# Altium project SeniorDesign_PowerBoard.PrjPcb
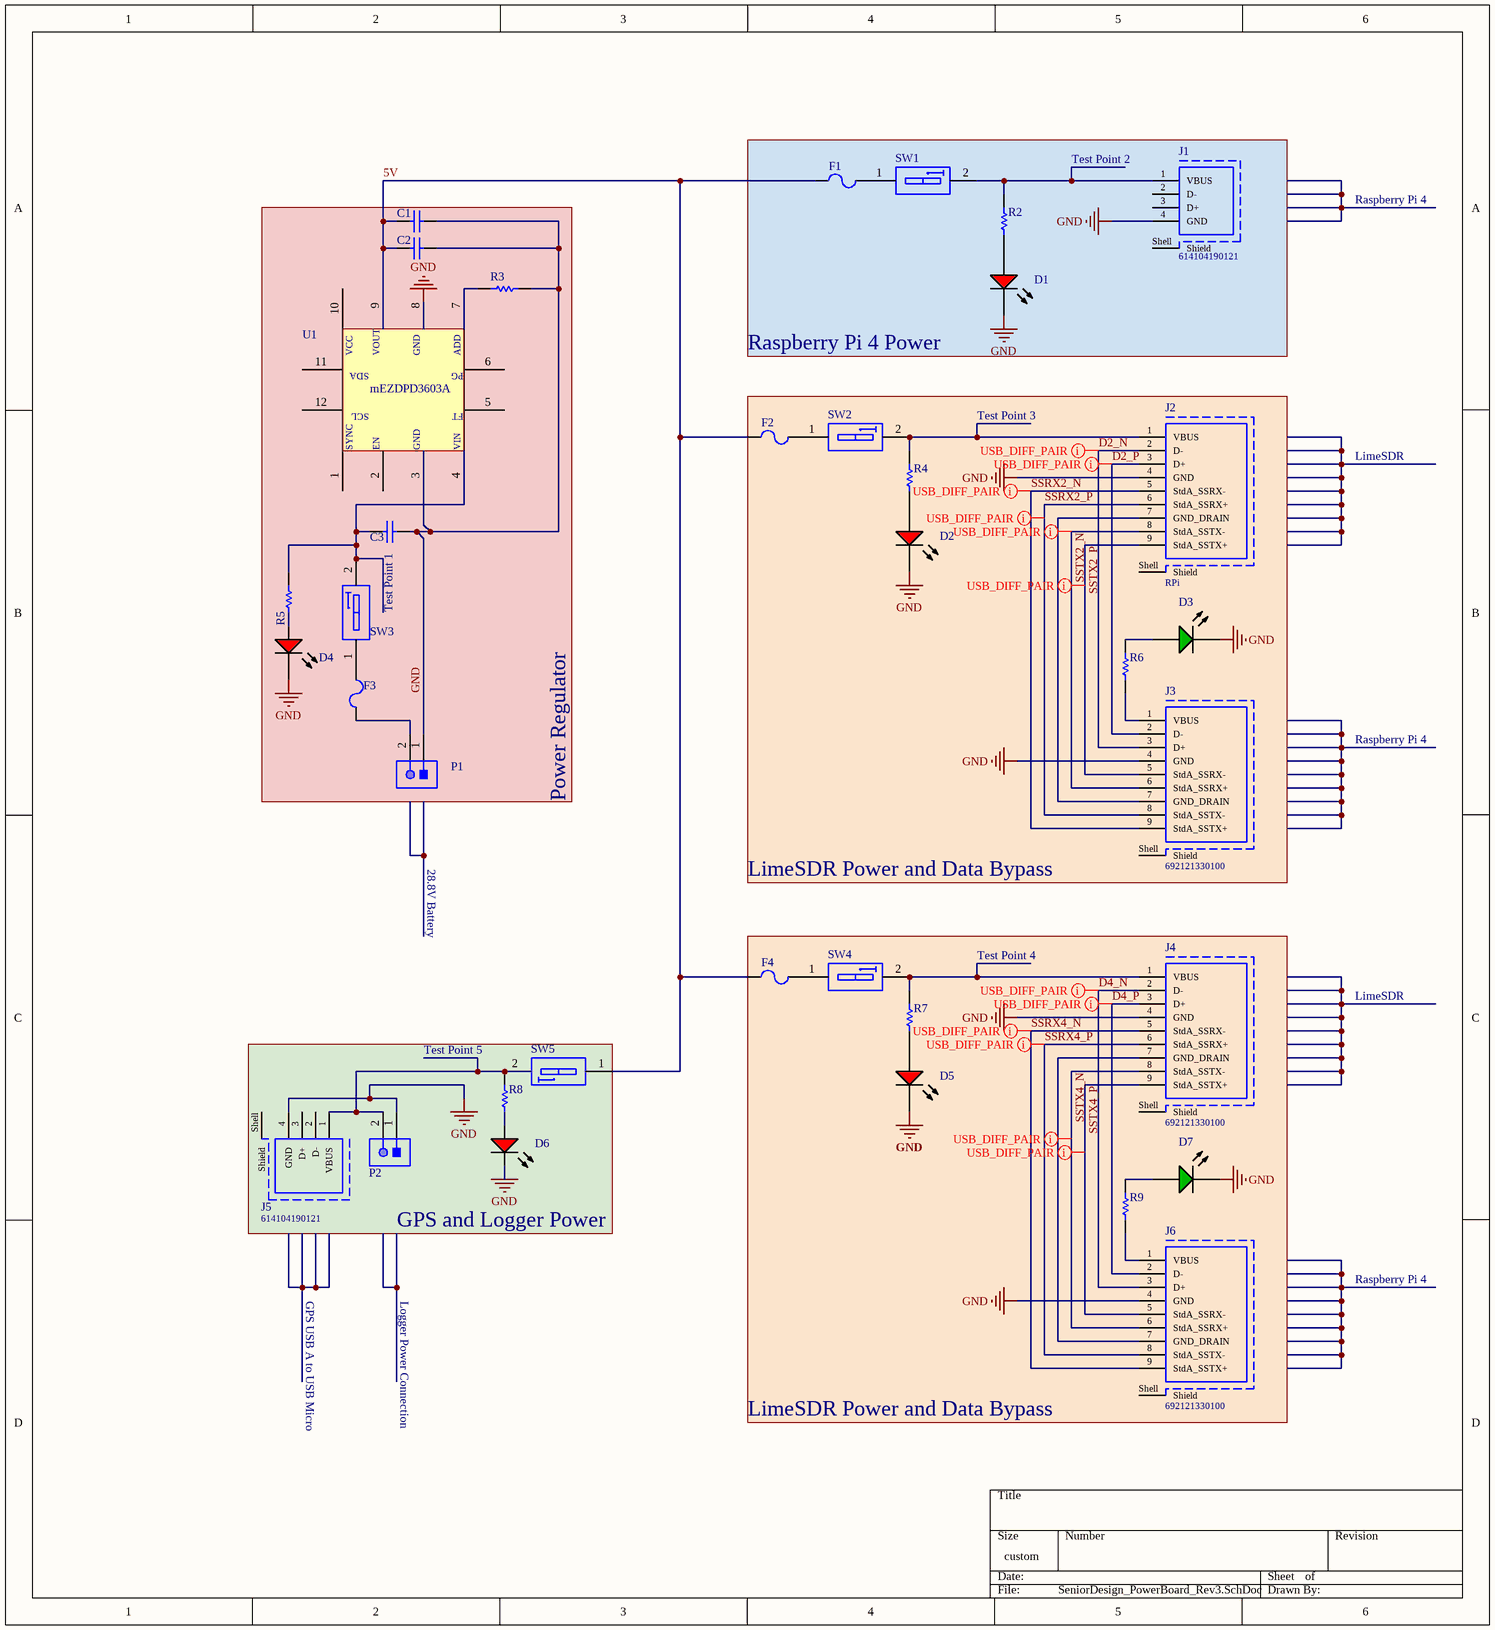
[diagram p0: SeniorDesign_PowerBoard_Rev3.SchDoc]
1 sheet, 36 parts. Net scope: global (net labels, ports and power ports of the same name join across sheets).
Board file: SeniorDesign_PowerBoard_Rev1.PcbDoc

## Sheet SeniorDesign_PowerBoard_Rev3.SchDoc
size 279 x 304 mm

### Parts
C1  GRM188R61A226ME15D  [CAPC1608X100X38LL20T18]  (value not drawn)
C2  GRM188R61A226ME15D  [CAPC1608X100X38LL20T18]  (value not drawn)
C3  GRM31CR71H475KA12L  [MURA-1206_H_1.8_M]  (value not drawn)
D1  HSMH-C150  [AVAG-HSMX-C150_V]  (value not drawn)
D2  HSMH-C150  [AVAG-HSMX-C150_V]  (value not drawn)
D3  HSMG-C150  [AVAG-HSMX-C150_V]  (value not drawn)
D4  HSMH-C150  [AVAG-HSMX-C150_V]  (value not drawn)
D5  HSMH-C150  [AVAG-HSMX-C150_V]  (value not drawn)
D6  HSMH-C150  [AVAG-HSMX-C150_V]  (value not drawn)
D7  HSMG-C150  [AVAG-HSMX-C150_V]  (value not drawn)
F1  0263.500WRT1L  [LFUS-263-2_V1]  (value not drawn)
F2  0263.500WRT1L  [LFUS-263-2_V1]  (value not drawn)
F3  0263.500WRT1L  [LFUS-263-2_V1]  (value not drawn)
F4  0263.500WRT1L  [LFUS-263-2_V1]  (value not drawn)
J1  614104190121  [614104190121]
J2  RPi  [692121330100]
J3  692121330100  [692121330100]
J4  692121330100  [692121330100]
J5  614104190121  [614104190121]
J6  692121330100  [692121330100]
P1  S2B-PH-K-S(LF)(SN)  [JST-S2B-PH-K-S_V]  (value not drawn)
P2  S2B-PH-K-S(LF)(SN)  [JST-S2B-PH-K-S_V]  (value not drawn)
R2  CRCW0402150RFKED  [RESC1005X40X25LL05T05]  (value not drawn)
R3  ADD  [RESC2013X50X30LL20T20]  (value not drawn)
R4  CRCW0402150RFKED  [RESC1005X40X25LL05T05]  (value not drawn)
R5  ERJ-8ENF1501V  [RESC3216X70X50LL05T20]  (value not drawn)
R6  CRCW0402150RFKED  [RESC1005X40X25LL05T05]  (value not drawn)
R7  CRCW0402150RFKED  [RESC1005X40X25LL05T05]  (value not drawn)
R8  CRCW0402150RFKED  [RESC1005X40X25LL05T05]  (value not drawn)
R9  CRCW0402150RFKED  [RESC1005X40X25LL05T05]  (value not drawn)
SW1  418121160801  [418121160801]  (value not drawn)
SW2  418121160801  [418121160801]  (value not drawn)
SW3  418121160801  [418121160801]  (value not drawn)
SW4  418121160801  [418121160801]  (value not drawn)
SW5  418121160801  [418121160801]  (value not drawn)
U1  DC/DC Converter  [mEZDPD3603A]  (value not drawn)

### Blocks framed on the sheet
Raspberry Pi 4 Power: D1 F1 J1 R2 SW1
Test Point 1: C1-C3 D4 F3 P1 R3 R5 SW3 U1
LimeSDR Power and Data Bypass: D2 D3 F2 J2 J3 R4 R6 SW2
LimeSDR Power and Data Bypass: D5 D7 F4 J4 J6 R7 R9 SW4
GPS and Logger Power: D6 J5 P2 R8 SW5

### Nets
GND: C1.1 C2.1 C3.1 D1.2(K) D2.2(K) D3.2(K) D4.2(K) D5.2(K) D6.2(K) D7.2(K) J1.4(GND) J2.4(GND) J3.4(GND) J4.4(GND) J5.4(GND) J6.4(GND) P1.1 P2.1 R3.1 U1.3(GND) U1.8(GND)
5V: C1.2 C2.2 F1.2 F2.2 F4.2 SW5.1 U1.9(VOUT)
D2_N: J2.2(D-) J3.3(D+)
D2_P: J2.3(D+) J3.2(D-)
D4_N: J4.2(D-) J6.3(D+)
D4_P: J4.3(D+) J6.2(D-)
SSRX2_N: J2.5(StdA_SSRX-) J3.9(StdA_SSTX+)
SSRX2_P: J2.6(StdA_SSRX+) J3.8(StdA_SSTX-)
SSRX4_N: J4.5(StdA_SSRX-) J6.9(StdA_SSTX+)
SSRX4_P: J4.6(StdA_SSRX+) J6.8(StdA_SSTX-)
SSTX2_N: J2.8(StdA_SSTX-) J3.6(StdA_SSRX+)
SSTX2_P: J2.9(StdA_SSTX+) J3.5(StdA_SSRX-)
SSTX4_N: J4.8(StdA_SSTX-) J6.6(StdA_SSRX+)
SSTX4_P: J4.9(StdA_SSTX+) J6.5(StdA_SSRX-)
NetC3_2: C3.2 R5.2 SW3.2 U1.4(VIN)
NetD1_1: D1.1(A) R2.1
NetD2_1: D2.1(A) R4.1
NetD3_1: D3.1(A) R6.2
NetD4_1: D4.1(A) R5.1
NetD5_1: D5.1(A) R7.1
NetD6_1: D6.1(A) R8.1
NetD7_1: D7.1(A) R9.2
NetF1_1: F1.1 SW1.1
NetF2_1: F2.1 SW2.1
NetF3_1: F3.1 P1.2
NetF3_2: F3.2 SW3.1
NetF4_1: F4.1 SW4.1
NetJ1_1: J1.1(VBUS) R2.2 SW1.2
NetJ2_1: J2.1(VBUS) R4.2 SW2.2
NetJ2_7: J2.7(GND_DRAIN) J3.7(GND_DRAIN)
NetJ3_1: J3.1(VBUS) R6.1
NetJ4_1: J4.1(VBUS) R7.2 SW4.2
NetJ4_7: J4.7(GND_DRAIN) J6.7(GND_DRAIN)
NetJ5_1: J5.1(VBUS) P2.2 R8.2 SW5.2
NetJ6_1: J6.1(VBUS) R9.1
NetR3_2: R3.2 U1.7(ADD)

Not connected (* = marked no-connect by the designer): J1 2(D-) 3(D+) Shell(Shield); J2 Shell(Shield); J3 Shell(Shield); J4 Shell(Shield); J5 2(D-) 3(D+) Shell(Shield); J6 Shell(Shield); U1 1(_SYNC) 2(EN) 5(FT) 6(PG) 10(VCC) 11(SDA) 12(SCL)

### Layout directives
differential pair; differential pair class USB_DIFF_PAIR: D2_N, D2_P, D4_N, D4_P, SSRX2_N, SSRX2_P, SSRX4_N, SSRX4_P, SSTX2_N, SSTX2_P, SSTX4_N, SSTX4_P

### Notes on the sheet
- (near J1) Test Point 2
- Raspberry Pi 4
- Test Point 3
- LimeSDR
- Power Regulator
- 28.8V Battery
- Test Point 4
- Test Point 5
- GPS USB A to USB Micro
- Logger Power Connection
- (in symbol DC/DC Converter) mEZDPD3603A

### Library data of the parts
C1 C2 = CMP-2000-06337-1: Chip Capacitor, 22 uF, +/- 20%, 10 V, -55 to 85 degC, 0603 (1608 Metric), RoHS, Tape and Reel; Manufacturer: Murata; Voltage Rating DC: 10VDC; Capacitance: 22uF; Dielectric: X5R; Unit Weight: 0.000222oz; Brand: MurataElectronics; Type: VoltageandTemperatureDeratingRecommendedProduct; Case Code - in: 0603; Package Reference: 1608; Package Description: 2-Pin Surface Mount Device, Body 1.6 x 0.8 mm; Width: 0.8mm; Factory Pack Quantity: 4000; Series: GRM; Product Category: MultilayerCeramicCapacitorsMLCC-SMD/SMT; Length: 1.6mm; Datasheet URL: http://download.siliconexpert.com/pdfs/2016/4/15/5/14/5/748/mrt_/manual/267693161154190grm188r61a226me1523.pdf; Termination Style: SMD/SMT; RoHS: True; Packaging: Reel; Datasheet Version: 04/2016; Minimum Operating Temperature: -55C; Tolerance: 20%; Height: 0.8mm; Package / Case: 0603(1608metric); Mounting Technology: SurfaceMount; Manufacturer URL: http://www.murata.com/; Product: GeneralTypeMLCCs; Maximum Operating Temperature: +85C; Case Code - mm: 1608
C3 = CMP-2000-05258-1: CAP, Ceramic, 4.7 uF, 10%, 50 V, 1206, RoHS, Tape and Reel; Manufacturer: Murata; Capacitance: 4700000pF; Dielectric: X7R; Rated Voltage: 50V; Manufacturer URL: http://www.murata.com/; Datasheet URL: https://datasheet.ciiva.com/29201/451984-da-01-en-vs-kondensator-0603-29201725.pdf; Datasheet Version: Dec-10; Case Size/Dimension: 1206; Tolerance (%): ±10%
D1 D2 D4-D6 = CMP-2000-06426-1: LED Uni-Color Red, 65 mW, 25 mA, -40 to 85 degC, 2-Pin SMD, RoHS, Tape and Reel; Manufacturer: Avago; Product Height (mm): 1.1mm; Power Dissipation: 78W; Product Length (mm): 3.2mm; Forward Voltage: 2.6V; Luminous Intensity: 17mcd; DELETED: Compliant; Shape Type: Rectangular; Peak Wavelength: 660nm; Main Category: ChipLED; Dominant Wave Length: 639nm; Rad Hardened: No; Lens Type: ColorlessDiffused; Product Depth (mm): 1.6mm; Reverse Voltage: 5V; Forward Current: 25mA; Chip Material: GaAlAs; Test Current (It): 20mA; Viewing Angle: 170deg; Number of  Elements: 1; Type: Uni-Color; Package Reference: HSMX-C150; Package Description: 2-Pin Surface Mount Device, Body 3.2 x 1.6 mm; Operating Temp Range: -40Cto85C; Mounting: SurfaceMount; Emitting Color: Red; Pin Count: 2; Operating Temperature Classification: Industrial; Datasheet URL: http://media.digikey.com/pdf/Data%20Sheets/Avago%20PDFs/HSMz-Czzz.pdf; Package Type: ChipLed; Mounting Technology: SurfaceMount; High Brightness: No; Lens Dimensions: 2x1.6x0.6mm; Manufacturer URL: http://www.avagotech.com/; Lum Intensity: 17mcd; Datasheet Version: 03/2012; Packaging: TapeandReel
D3 D7 = CMP-2000-05061-1: Chip LED, Green, 65 mW, 25 mA, -40 to 85 degC, 2-Pin SMD, RoHS, Tape and Reel; Manufacturer: Avago; Forward Voltage VF Max: 2.6V; Forward Current If Max: 20mA; Bulb Size: 1.6mmx2mm; PIV Max: 5V; Dominant Wavelength: 572nm; External Length / Height: 3.2mm; SVHC: NoSVHC(16-Jun-2014); Viewing Angle: 170deg; Peak Wavelength: 570nm; External Width: 1.6mm; No. of Pins: 2; Luminous Intensity Typ: 15mcd; Light Output Orientation: TopEmitting; LED Type: Standard; Luminous Intensity @ If Min: 4.5mcd; Voltage Vf Min: 2.2V; Lens Shape: Rectangular; External Depth: 1.1mm; Material: GaP; Opto Mounting Orientation: Top; Package Reference: HSMX-C150; Mounting Type: SMD; Datasheet Version: Mar-12; Storage Temperature Max: 85degC; Forward Current If: 20mA; Operating Temperature Min: -30degC; Operating Temperature Max: 85degC; Wavelength Typ: 572nm; Datasheet URL: https://datasheet.ciiva.com/11774/0900766b804a6539-11774272.pdf; Luminous Intensity: 15mcd; Manufacturer URL: http://www.avagotech.com/; Storage Temperature Min: -40degC; Package Description: 2-Pin Surface Mount Device, Body 3.2 x 1.6 mm; MSL: MSL2A-4weeks; LED Colour: Green; Operating Temperature Range: -30degCto+85degC; LED Mounting: SMD; Voltage Vf Typ: 2.2V; Opto Case Style: SMD; Packaging: CutTape; Forward Voltage: 2.2V; Reverse Protection Voltage: 5V
F1-F4 = CMP-0951-00001-1: Very Fast-Acting Subminiature Fuse, 250 V, 0.5 A, 2-Pin Axial Leaded, Dia 3.94 mm, Body Length 7.11 mm, RoHS, Tape and Reel; Manufacturer: Littelfuse; Nominal Voltage Drop: 0.302 mV; Ampere Rating: 0.5 A; Typical Cold Resistance: 0.332 Ohm; Voltage Rating: 250 V; Temp. Range: -55 to 125 degC; Mounting Technology: Through Hole; RoHS: TRUE; PartNumber: 0263.500WRT1L; ComponentLink1Description: Manufacturer URL; DatasheetVersion: Dec-13; ComponentLink2URL: http://www.littelfuse.com/~/media/electronics/datasheets/fuses/littelfuse_fuse_263_datasheet.pdf.pdf; PackageReference: 263-2; Packing: Tape and Reel; PackageDescription: 2-Pin Axial Lead, Dia 3.94 mm, Body Length 7.11 mm; ComponentLink2Description: Datasheet; ComponentLink1URL: http://www.littelfuse.com/
J1 J5 = CMP-1502-03231-1: USB 2.0 Type A Receptacle WR-COM, Horizontal, THT, Short Type with Clips; Manufacturer: Wurth Elektronik; Contact Resistance: 30mOhm; Rated Current: 1.5A; Working Voltage: 30VAC; Publisher: WurthElektronik; Operating Temperature: -55to85degC; Part Number: 614104190121; Package Reference: 614104190121; Orientation: Horizontal; Gender: Receptacle; Packaging: TapeandReel; Mounting Technology: THT; Datasheet URL: https://katalog.we-online.de/em/datasheet/614104190121.pdf; Connector Type: USB2.0TypeA; Manufacturer URL: http://www.we-online.de
J2-J4 J6 = CMP-1502-03219-1: USB 3.0 Type A Receptacle WR-COM, Reverse Horizontal, SMT / THT, with Clips, with 1.75 mm Offset; Manufacturer: Wurth Elektronik; Rated Current: 0.25A; Working Voltage: 30VAC; Contact Resistance: 50mOhm; Package Reference: 692121330100; Operating Temperature: -20to85degC; Datasheet URL: https://katalog.we-online.de/em/datasheet/692121330100.pdf; Part Number: 692121330100; Gender: Receptacle; Connector Type: USB3.0TypeA; Publisher: WurthElektronik; Orientation: ReverseHorizontal; Mounting Technology: SMT/THT; Packaging: TapeandReel; Manufacturer URL: http://www.we-online.de
P1 P2 = CMP-1755-00004-1: Male Header, Pitch 2 mm, 1 x 2 Position, Height 4.8 mm, Tail Length 3.4 mm, -25 to 85 degC, RoHS, Bulk; Case\Package: Radial; Tolerance: 20%; Capacitance: 10 uF; Voltage Rating (DC): 50 V; Packaging: Bulk; ComponentLink1URL: http://www.jst-mfg.com/product/pdf/eng/ePH.pdf; Radiation Hardening: No; Height: 11 mm; Package Quantity: 200; PackageDescription: Male Header, Pitch 2 mm, 1 x 2 Position, Height 4.8 mm, Tail Length 3.4 mm; PackageReference: S2B-PH-K-S; Diameter: 5 mm; Pins: 2; Mount: Through Hole; Max Operating Temperature: 85 degC; Min Operating Temperature: -40 degC; ComponentLink1Description: Datasheet; DatasheetVersion: Dec-12; Length: 11 mm; Lead Pitch: 2 mm; REACH SVHC: No SVHC; Voltage Rating: 50 V; RoHSCompliant: true
R2 R4 R6-R9 = CMP-2002-08214-1: Manufacturer: Vishay Dale; Part Number: CRCW0402150RFKED
R3 = CMP-2001-04896-1: Manufacturer: Vishay Dale; Part Number: CRCW08050000Z0EA
R5 = CMP-2003-00117-1: 1k5 Ohm; Manufacturer: Panasonic; Part Number: ERJ-8ENF1501V
SW1-SW5 = CMP-1437-00001-1: WS-DISV 2.54 mm small compact SMD Dip Switch with top tape; Manufacturer: Wuerth Elektronik; NoPins: 02; ComponentLink2Description: Datasheet; ComponentLink1Description: Manufacturer URL; ComponentLink2URL: http://katalog.we-online.de/em/datasheet/4181211608xx.pdf; PartNumber: 418121160801; ComponentLink1URL: http://www.we-online.com; PackageReference: 418121160801